# EAGLE design Mxxx (EAGLE 6.6.0)

## Sheet 1 of 6
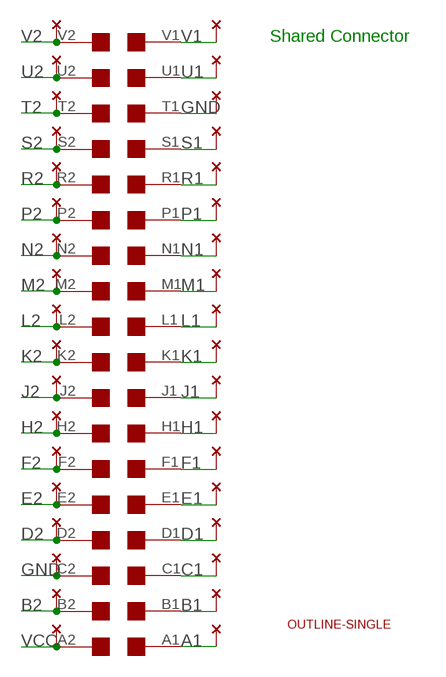
[diagram p0: schematic, sheet 1]

### Parts
U$1  EDGE-2CONNECTOR  [EDGE-CON2]
U$4  THRU-HOLE2A  [THRU-HOLEA]
U$5  OUTLINE-SINGLE  [SINGLE]

### Nets
A1: U$1.A1 U$4.A1 ; also sheet 2,3,4,5,6
B1: U$1.B1 U$4.B1 ; also sheet 2,3,4,5,6
B2: U$1.B2 U$4.B2
C1: U$1.C1 U$4.C1 ; also sheet 2,3,4,5,6
D1: U$1.D1 U$4.D1 ; also sheet 2,3,4,5,6
D2: U$1.D2 U$4.D2 ; also sheet 2,3,4,5,6
E1: U$1.E1 U$4.E1 ; also sheet 2,3,4,5
E2: U$1.E2 U$4.E2 ; also sheet 2,3,4,5,6
F1: U$1.F1 U$4.F1 ; also sheet 2,3,4,5,6
F2: U$1.F2 U$4.F2 ; also sheet 2,3,4,5,6
GND [Power]: U$1.C2 U$1.T1 U$4.C2 U$4.T1 ; also sheet 2,3,4,5,6
H1: U$1.H1 U$4.H1 ; also sheet 2,3,4,5,6
H2: U$1.H2 U$4.H2 ; also sheet 2,3,4,5,6
J1: U$1.J1 U$4.J1 ; also sheet 2,3,4,5,6
J2: U$1.J2 U$4.J2 ; also sheet 2,3,4,5,6
K1: U$1.K1 U$4.K1 ; also sheet 2,3,4,5,6
K2: U$1.K2 U$4.K2 ; also sheet 2,3,4,5,6
L1: U$1.L1 U$4.L1 ; also sheet 2,3,4,5
L2: U$1.L2 U$4.L2 ; also sheet 2,3,4,5,6
M1: U$1.M1 U$4.M1 ; also sheet 2,3,4,5,6
M2: U$1.M2 U$4.M2 ; also sheet 2,3,4,5,6
N1: U$1.N1 U$4.N1 ; also sheet 2,3,4,5,6
N2: U$1.N2 U$4.N2 ; also sheet 2,3,4,5,6
P1: U$1.P1 U$4.P1 ; also sheet 2,3,4,5,6
P2: U$1.P2 U$4.P2 ; also sheet 2,3,4,5,6
R1: U$1.R1 U$4.R1 ; also sheet 2,3,4,5,6
R2: U$1.R2 U$4.R2 ; also sheet 2,3,4,5,6
S1: U$1.S1 U$4.S2 ; also sheet 2,3,4,5
S2: U$1.S2 U$4.S1 ; also sheet 2,3,4,5,6
T2: U$1.T2 U$4.T2 ; also sheet 2,3,4,5,6
U1: U$1.U1 U$4.U1 ; also sheet 2,3,4
U2: U$1.U2 U$4.U2 ; also sheet 2,3,4,5,6
V1: U$1.V1 U$4.V1 ; also sheet 2,3,4
V2: U$1.V2 U$4.V2 ; also sheet 2,3,4,5,6
VCC [Power]: U$1.A2 U$4.A2 ; also sheet 2,3,4,5,6

### Notes on the sheet
- Shared Connector

## Sheet 2 of 6
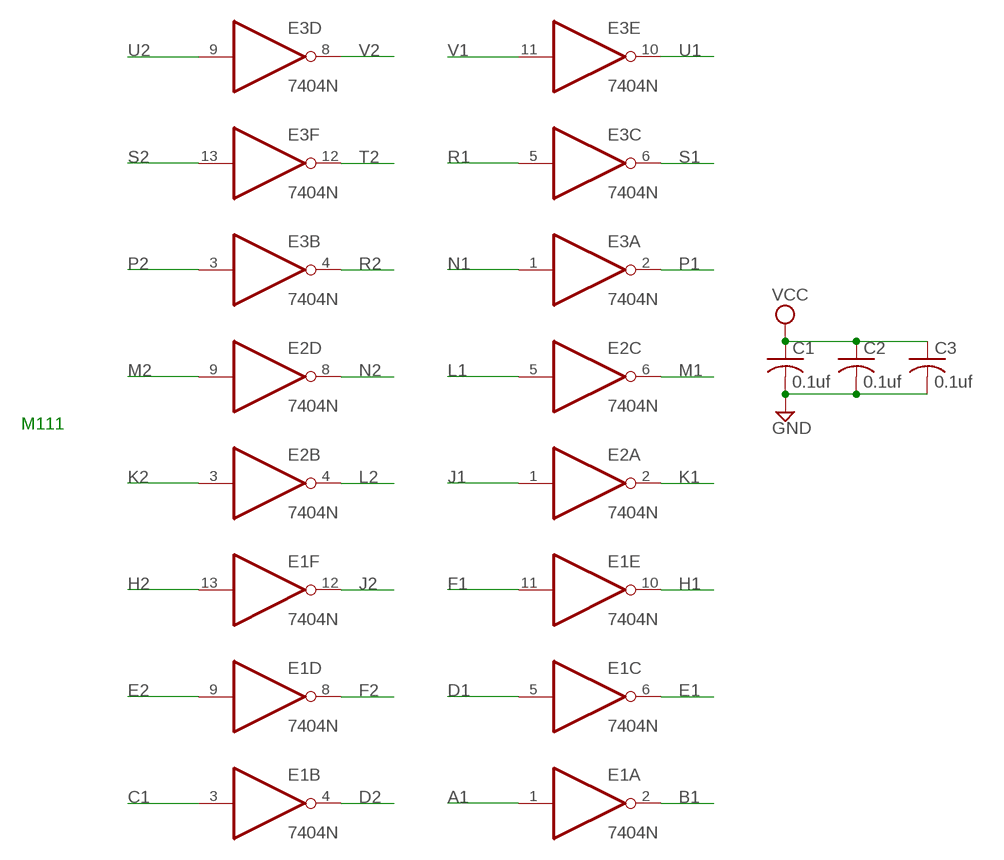
[diagram p1: schematic, sheet 2]

### Parts
C1  0.1uf  C-US050-025X075  [C050-025X075]
C2  0.1uf  C-US050-025X075  [C050-025X075]
C3  0.1uf  C-US050-025X075  [C050-025X075]
E1  7404N  [DIL14]
E2  7404N  [DIL14]
E3  7404N  [DIL14]

### Nets
A1: E1.1(A:I) ; also sheet 1,3,4,5,6
B1: E1.2(A:O) ; also sheet 1,3,4,5,6
C1: E1.3(B:I) ; also sheet 1,3,4,5,6
D1: E1.5(C:I) ; also sheet 1,3,4,5,6
D2: E1.4(B:O) ; also sheet 1,3,4,5,6
E1: E1.6(C:O) ; also sheet 1,3,4,5
E2: E1.9(D:I) ; also sheet 1,3,4,5,6
F1: E1.11(E:I) ; also sheet 1,3,4,5,6
F2: E1.8(D:O) ; also sheet 1,3,4,5,6
GND [Power]: C1.2 C2.2 C3.2 ; also sheet 1,3,4,5,6
H1: E1.10(E:O) ; also sheet 1,3,4,5,6
H2: E1.13(F:I) ; also sheet 1,3,4,5,6
J1: E2.1(A:I) ; also sheet 1,3,4,5,6
J2: E1.12(F:O) ; also sheet 1,3,4,5,6
K1: E2.2(A:O) ; also sheet 1,3,4,5,6
K2: E2.3(B:I) ; also sheet 1,3,4,5,6
L1: E2.5(C:I) ; also sheet 1,3,4,5
L2: E2.4(B:O) ; also sheet 1,3,4,5,6
M1: E2.6(C:O) ; also sheet 1,3,4,5,6
M2: E2.9(D:I) ; also sheet 1,3,4,5,6
N1: E3.1(A:I) ; also sheet 1,3,4,5,6
N2: E2.8(D:O) ; also sheet 1,3,4,5,6
P1: E3.2(A:O) ; also sheet 1,3,4,5,6
P2: E3.3(B:I) ; also sheet 1,3,4,5,6
R1: E3.5(C:I) ; also sheet 1,3,4,5,6
R2: E3.4(B:O) ; also sheet 1,3,4,5,6
S1: E3.6(C:O) ; also sheet 1,3,4,5
S2: E3.13(F:I) ; also sheet 1,3,4,5,6
T2: E3.12(F:O) ; also sheet 1,3,4,5,6
U1: E3.10(E:O) ; also sheet 1,3,4
U2: E3.9(D:I) ; also sheet 1,3,4,5,6
V1: E3.11(E:I) ; also sheet 1,3,4
V2: E3.8(D:O) ; also sheet 1,3,4,5,6
VCC [Power]: C1.1 C2.1 C3.1 ; also sheet 1,3,4,5,6
Unconnected: E2.10(E:O) E2.11(E:I) E2.12(F:O) E2.13(F:I)

### Notes on the sheet
- M111

## Sheet 3 of 6
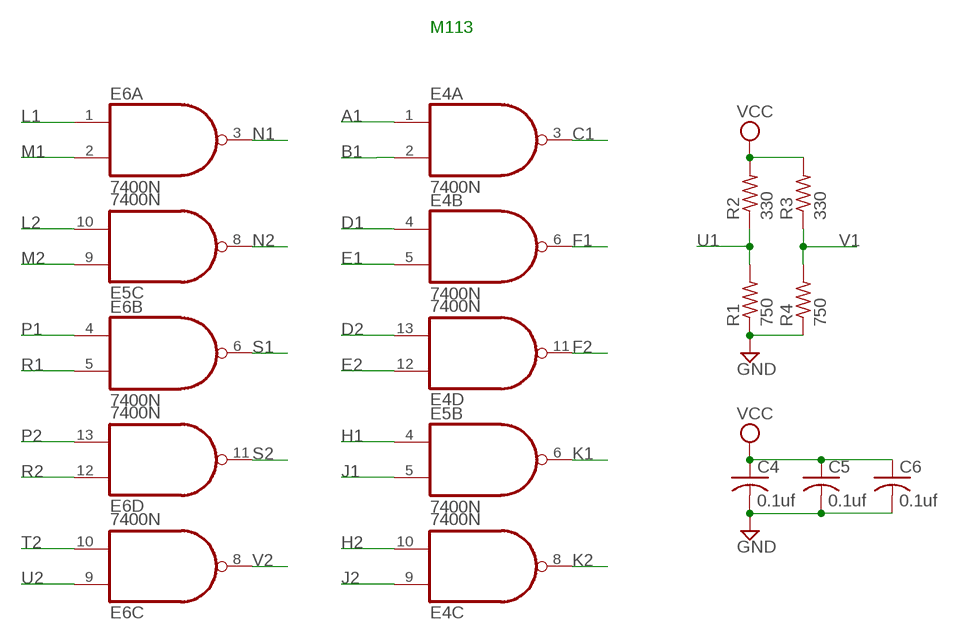
[diagram p2: schematic, sheet 3]

### Parts
C4  0.1uf  C-US050-025X075  [C050-025X075]
C5  0.1uf  C-US050-025X075  [C050-025X075]
C6  0.1uf  C-US050-025X075  [C050-025X075]
E4  7400N  [DIL14]
E5  7400N  [DIL14]
E6  7400N  [DIL14]
R1  750  R-US_0207/10  [0207/10]
R2  330  R-US_0207/10  [0207/10]
R3  330  R-US_0207/10  [0207/10]
R4  750  R-US_0207/10  [0207/10]

### Nets
A1: E4.1(A:I0) ; also sheet 1,2,4,5,6
B1: E4.2(A:I1) ; also sheet 1,2,4,5,6
C1: E4.3(A:O) ; also sheet 1,2,4,5,6
D1: E4.4(B:I0) ; also sheet 1,2,4,5,6
D2: E4.13(D:I1) ; also sheet 1,2,4,5,6
E1: E4.5(B:I1) ; also sheet 1,2,4,5
E2: E4.12(D:I0) ; also sheet 1,2,4,5,6
F1: E4.6(B:O) ; also sheet 1,2,4,5,6
F2: E4.11(D:O) ; also sheet 1,2,4,5,6
GND [Power]: C4.2 C5.2 C6.2 R1.1 R4.1 ; also sheet 1,2,4,5,6
H1: E5.4(B:I0) ; also sheet 1,2,4,5,6
H2: E4.10(C:I1) ; also sheet 1,2,4,5,6
J1: E5.5(B:I1) ; also sheet 1,2,4,5,6
J2: E4.9(C:I0) ; also sheet 1,2,4,5,6
K1: E5.6(B:O) ; also sheet 1,2,4,5,6
K2: E4.8(C:O) ; also sheet 1,2,4,5,6
L1: E6.1(A:I0) ; also sheet 1,2,4,5
L2: E5.10(C:I1) ; also sheet 1,2,4,5,6
M1: E6.2(A:I1) ; also sheet 1,2,4,5,6
M2: E5.9(C:I0) ; also sheet 1,2,4,5,6
N1: E6.3(A:O) ; also sheet 1,2,4,5,6
N2: E5.8(C:O) ; also sheet 1,2,4,5,6
P1: E6.4(B:I0) ; also sheet 1,2,4,5,6
P2: E6.13(D:I1) ; also sheet 1,2,4,5,6
R1: E6.5(B:I1) ; also sheet 1,2,4,5,6
R2: E6.12(D:I0) ; also sheet 1,2,4,5,6
S1: E6.6(B:O) ; also sheet 1,2,4,5
S2: E6.11(D:O) ; also sheet 1,2,4,5,6
T2: E6.10(C:I1) ; also sheet 1,2,4,5,6
U1: R1.2 R2.1 ; also sheet 1,2,4
U2: E6.9(C:I0) ; also sheet 1,2,4,5,6
V1: R3.1 R4.2 ; also sheet 1,2,4
V2: E6.8(C:O) ; also sheet 1,2,4,5,6
VCC [Power]: C4.1 C5.1 C6.1 R2.2 R3.2 ; also sheet 1,2,4,5,6
Unconnected: E5.1(A:I0) E5.2(A:I1) E5.3(A:O) E5.11(D:O) E5.12(D:I0) E5.13(D:I1)

### Notes on the sheet
- M113

## Sheet 4 of 6
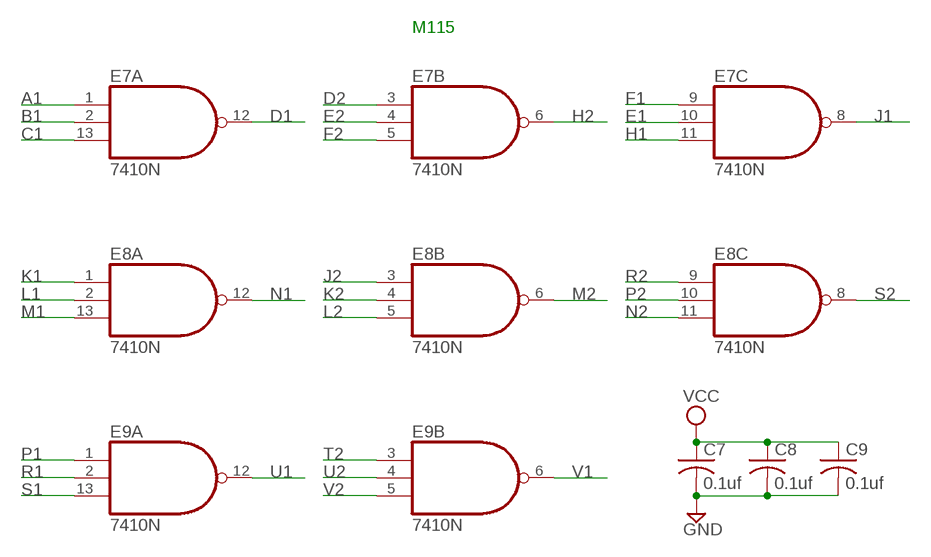
[diagram p3: schematic, sheet 4]

### Parts
C7  0.1uf  C-US050-025X075  [C050-025X075]
C8  0.1uf  C-US050-025X075  [C050-025X075]
C9  0.1uf  C-US050-025X075  [C050-025X075]
E7  7410N  [DIL14]
E8  7410N  [DIL14]
E9  7410N  [DIL14]

### Nets
A1: E7.1(A:I0) ; also sheet 1,2,3,5,6
B1: E7.2(A:I1) ; also sheet 1,2,3,5,6
C1: E7.13(A:I2) ; also sheet 1,2,3,5,6
D1: E7.12(A:O) ; also sheet 1,2,3,5,6
D2: E7.3(B:I0) ; also sheet 1,2,3,5,6
E1: E7.10(C:I1) ; also sheet 1,2,3,5
E2: E7.4(B:I1) ; also sheet 1,2,3,5,6
F1: E7.9(C:I0) ; also sheet 1,2,3,5,6
F2: E7.5(B:I2) ; also sheet 1,2,3,5,6
GND [Power]: C7.2 C8.2 C9.2 ; also sheet 1,2,3,5,6
H1: E7.11(C:I2) ; also sheet 1,2,3,5,6
H2: E7.6(B:O) ; also sheet 1,2,3,5,6
J1: E7.8(C:O) ; also sheet 1,2,3,5,6
J2: E8.3(B:I0) ; also sheet 1,2,3,5,6
K1: E8.1(A:I0) ; also sheet 1,2,3,5,6
K2: E8.4(B:I1) ; also sheet 1,2,3,5,6
L1: E8.2(A:I1) ; also sheet 1,2,3,5
L2: E8.5(B:I2) ; also sheet 1,2,3,5,6
M1: E8.13(A:I2) ; also sheet 1,2,3,5,6
M2: E8.6(B:O) ; also sheet 1,2,3,5,6
N1: E8.12(A:O) ; also sheet 1,2,3,5,6
N2: E8.11(C:I2) ; also sheet 1,2,3,5,6
P1: E9.1(A:I0) ; also sheet 1,2,3,5,6
P2: E8.10(C:I1) ; also sheet 1,2,3,5,6
R1: E9.2(A:I1) ; also sheet 1,2,3,5,6
R2: E8.9(C:I0) ; also sheet 1,2,3,5,6
S1: E9.13(A:I2) ; also sheet 1,2,3,5
S2: E8.8(C:O) ; also sheet 1,2,3,5,6
T2: E9.3(B:I0) ; also sheet 1,2,3,5,6
U1: E9.12(A:O) ; also sheet 1,2,3
U2: E9.4(B:I1) ; also sheet 1,2,3,5,6
V1: E9.6(B:O) ; also sheet 1,2,3
V2: E9.5(B:I2) ; also sheet 1,2,3,5,6
VCC [Power]: C7.1 C8.1 C9.1 ; also sheet 1,2,3,5,6
Unconnected: E9.8(C:O) E9.9(C:I0) E9.10(C:I1) E9.11(C:I2)

### Notes on the sheet
- M115

## Sheet 5 of 6
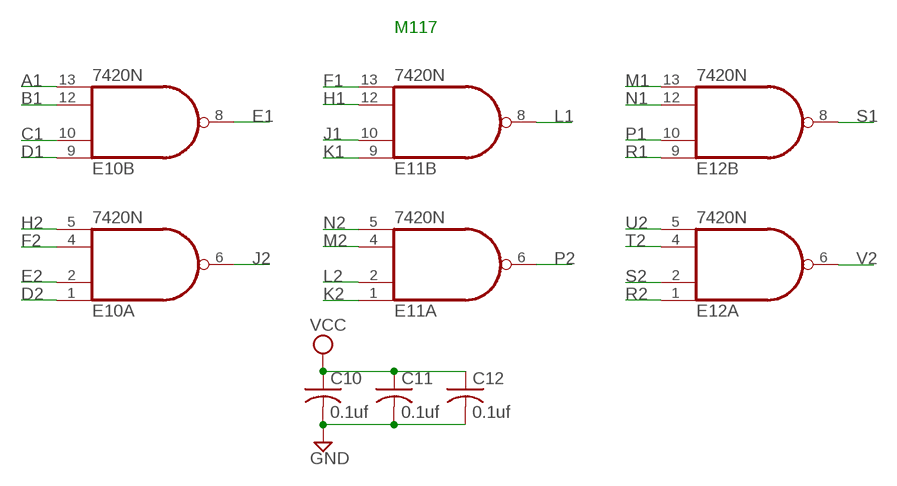
[diagram p4: schematic, sheet 5]

### Parts
C10  0.1uf  C-US050-025X075  [C050-025X075]
C11  0.1uf  C-US050-025X075  [C050-025X075]
C12  0.1uf  C-US050-025X075  [C050-025X075]
E10  7420N  74S20N  [DIL14]
E11  7420N  74S20N  [DIL14]
E12  7420N  74S20N  [DIL14]

### Nets
A1: E10.13(B:I3) ; also sheet 1,2,3,4,6
B1: E10.12(B:I2) ; also sheet 1,2,3,4,6
C1: E10.10(B:I1) ; also sheet 1,2,3,4,6
D1: E10.9(B:I0) ; also sheet 1,2,3,4,6
D2: E10.1(A:I0) ; also sheet 1,2,3,4,6
E1: E10.8(B:O) ; also sheet 1,2,3,4
E2: E10.2(A:I1) ; also sheet 1,2,3,4,6
F1: E11.13(B:I3) ; also sheet 1,2,3,4,6
F2: E10.4(A:I2) ; also sheet 1,2,3,4,6
GND [Power]: C10.2 C11.2 C12.2 ; also sheet 1,2,3,4,6
H1: E11.12(B:I2) ; also sheet 1,2,3,4,6
H2: E10.5(A:I3) ; also sheet 1,2,3,4,6
J1: E11.10(B:I1) ; also sheet 1,2,3,4,6
J2: E10.6(A:O) ; also sheet 1,2,3,4,6
K1: E11.9(B:I0) ; also sheet 1,2,3,4,6
K2: E11.1(A:I0) ; also sheet 1,2,3,4,6
L1: E11.8(B:O) ; also sheet 1,2,3,4
L2: E11.2(A:I1) ; also sheet 1,2,3,4,6
M1: E12.13(B:I3) ; also sheet 1,2,3,4,6
M2: E11.4(A:I2) ; also sheet 1,2,3,4,6
N1: E12.12(B:I2) ; also sheet 1,2,3,4,6
N2: E11.5(A:I3) ; also sheet 1,2,3,4,6
P1: E12.10(B:I1) ; also sheet 1,2,3,4,6
P2: E11.6(A:O) ; also sheet 1,2,3,4,6
R1: E12.9(B:I0) ; also sheet 1,2,3,4,6
R2: E12.1(A:I0) ; also sheet 1,2,3,4,6
S1: E12.8(B:O) ; also sheet 1,2,3,4
S2: E12.2(A:I1) ; also sheet 1,2,3,4,6
T2: E12.4(A:I2) ; also sheet 1,2,3,4,6
U2: E12.5(A:I3) ; also sheet 1,2,3,4,6
V2: E12.6(A:O) ; also sheet 1,2,3,4,6
VCC [Power]: C10.1 C11.1 C12.1 ; also sheet 1,2,3,4,6

### Notes on the sheet
- M117

## Sheet 6 of 6
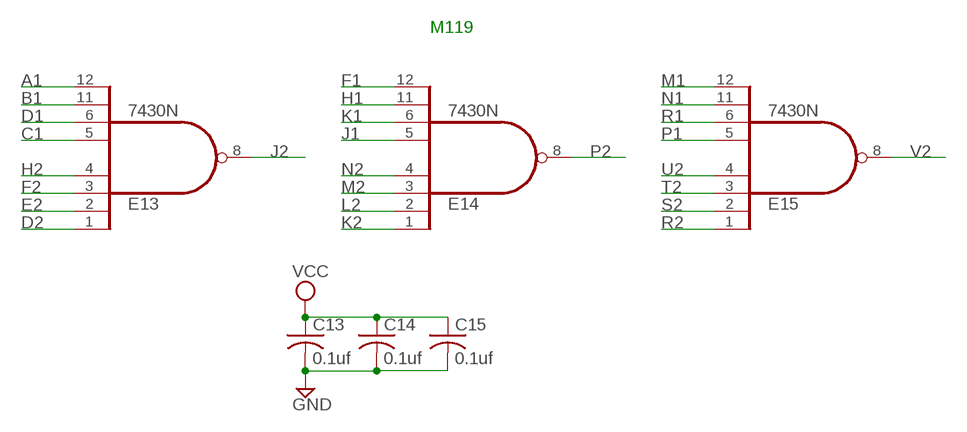
[diagram p5: schematic, sheet 6]

### Parts
C13  0.1uf  C-US050-025X075  [C050-025X075]
C14  0.1uf  C-US050-025X075  [C050-025X075]
C15  0.1uf  C-US050-025X075  [C050-025X075]
E13  7430N  [DIL14]
E14  7430N  [DIL14]
E15  7430N  [DIL14]

### Nets
A1: E13.12(I7) ; also sheet 1,2,3,4,5
B1: E13.11(I6) ; also sheet 1,2,3,4,5
C1: E13.5(I4) ; also sheet 1,2,3,4,5
D1: E13.6(I5) ; also sheet 1,2,3,4,5
D2: E13.1(I0) ; also sheet 1,2,3,4,5
E2: E13.2(I1) ; also sheet 1,2,3,4,5
F1: E14.12(I7) ; also sheet 1,2,3,4,5
F2: E13.3(I2) ; also sheet 1,2,3,4,5
GND [Power]: C13.2 C14.2 C15.2 ; also sheet 1,2,3,4,5
H1: E14.11(I6) ; also sheet 1,2,3,4,5
H2: E13.4(I3) ; also sheet 1,2,3,4,5
J1: E14.5(I4) ; also sheet 1,2,3,4,5
J2: E13.8(O) ; also sheet 1,2,3,4,5
K1: E14.6(I5) ; also sheet 1,2,3,4,5
K2: E14.1(I0) ; also sheet 1,2,3,4,5
L2: E14.2(I1) ; also sheet 1,2,3,4,5
M1: E15.12(I7) ; also sheet 1,2,3,4,5
M2: E14.3(I2) ; also sheet 1,2,3,4,5
N1: E15.11(I6) ; also sheet 1,2,3,4,5
N2: E14.4(I3) ; also sheet 1,2,3,4,5
P1: E15.5(I4) ; also sheet 1,2,3,4,5
P2: E14.8(O) ; also sheet 1,2,3,4,5
R1: E15.6(I5) ; also sheet 1,2,3,4,5
R2: E15.1(I0) ; also sheet 1,2,3,4,5
S2: E15.2(I1) ; also sheet 1,2,3,4,5
T2: E15.3(I2) ; also sheet 1,2,3,4,5
U2: E15.4(I3) ; also sheet 1,2,3,4,5
V2: E15.8(O) ; also sheet 1,2,3,4,5
VCC [Power]: C13.1 C14.1 C15.1 ; also sheet 1,2,3,4,5

### Notes on the sheet
- M119

## Power pins joined to a net without a drawn wire
GND: E1.7(P:GND) E2.7(P:GND) E3.7(P:GND) E4.7(P:GND) E5.7(P:GND) E6.7(P:GND) E7.7(P:GND) E8.7(P:GND) E9.7(P:GND) E10.7(P:GND) E11.7(P:GND) E12.7(P:GND) E13.7(GND) E14.7(GND) E15.7(GND)
VCC: E1.14(P:VCC) E2.14(P:VCC) E3.14(P:VCC) E4.14(P:VCC) E5.14(P:VCC) E6.14(P:VCC) E7.14(P:VCC) E8.14(P:VCC) E9.14(P:VCC) E10.14(P:VCC) E11.14(P:VCC) E12.14(P:VCC) E13.14(VCC) E14.14(VCC) E15.14(VCC)

## Library data of the parts
C1-C15 = rcl:C-US: CAPACITOR, American symbol
E1-E3 = 74xx-us:74*04: Hex INVERTER
E4-E6 = 74xx-us:74*00: Quad 2-input NAND gate
E7-E9 = 74xx-us:74*10: Triple 3-input NAND gate
E10-E12 = 74xx-us:74*20: Dual 4-input NAND gate
E13-E15 = 74xx-us:74*30: 8-input NAND gate
R1-R4 = rcl:R-US_: RESISTOR, American symbol
U$1 = dec-con:EDGE-2: Double-Sided DEC edge connector.
U$4 = dec-con:THRU-HOLE2: Thru-Hole addition to double-sided edge connector.
U$5 = dec-con:OUTLINE-*: Board outlines for DEC boards.

## Net classes
1 Power: width 0.381 mm

## Board
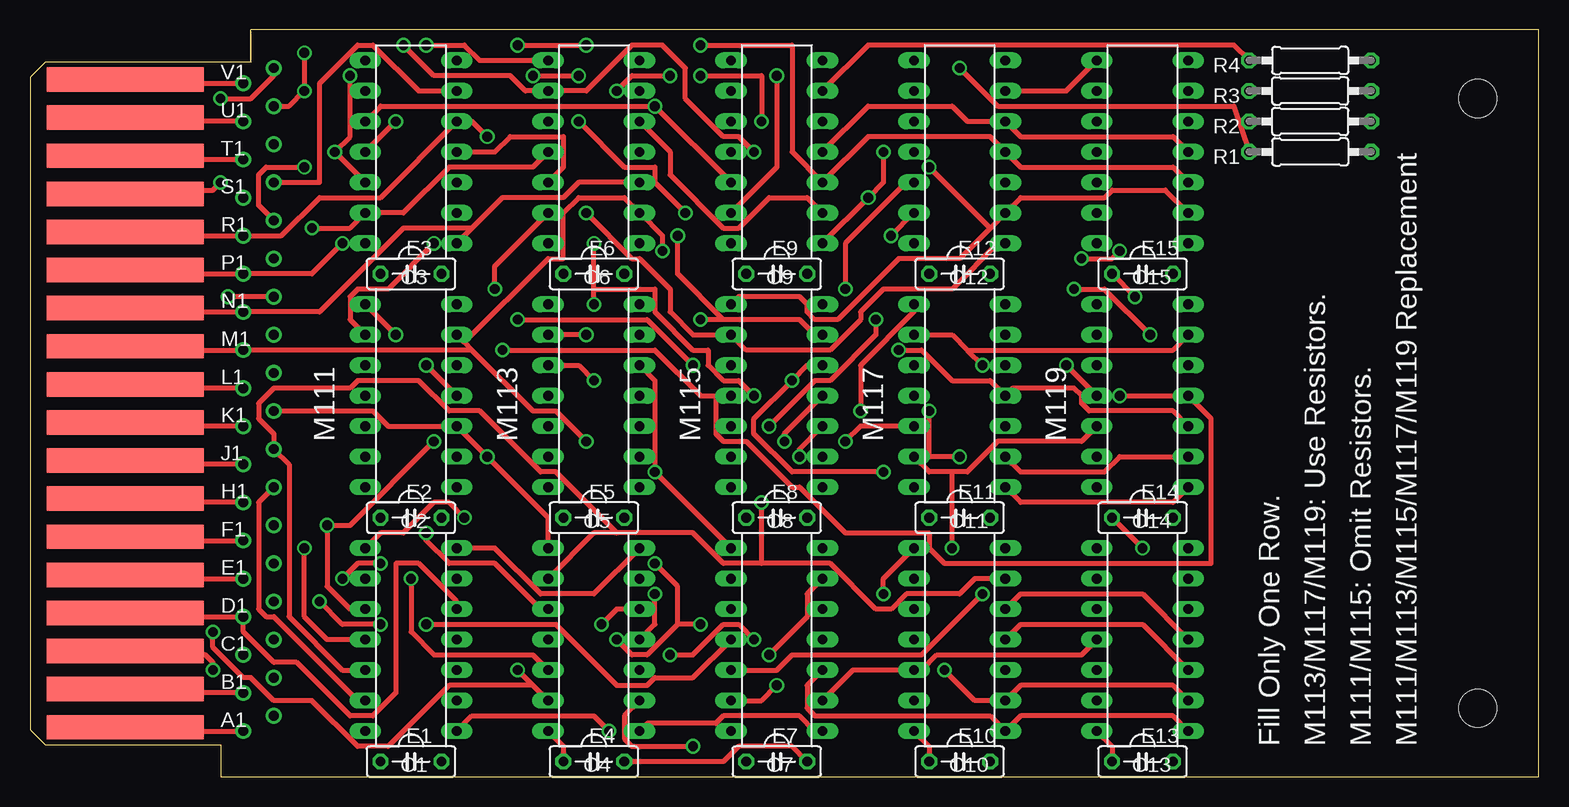
[diagram p6: board, top side]
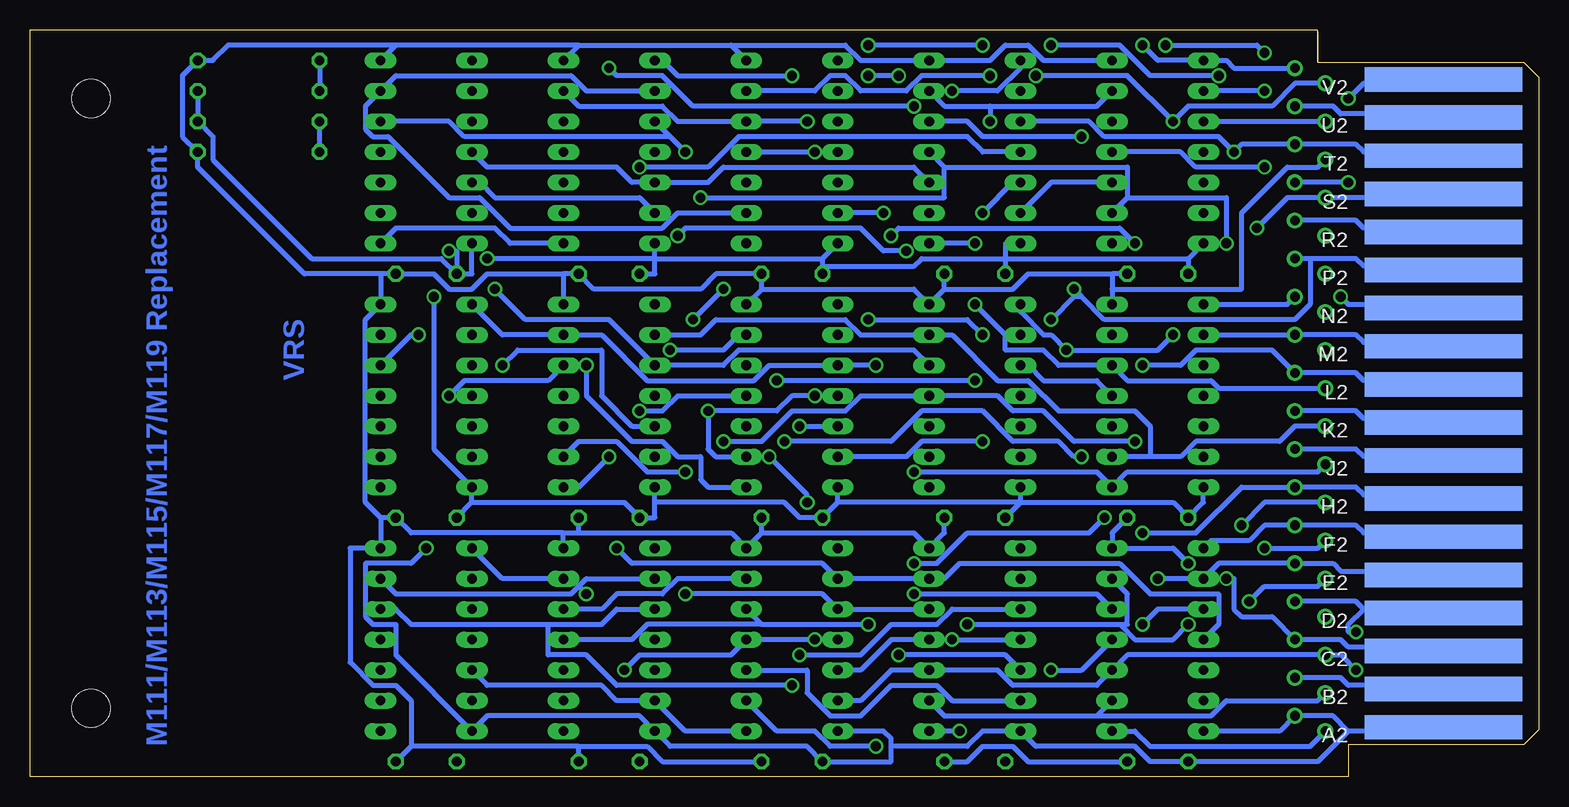
[diagram p7: board, bottom side, seen from below]

Size 125.73 x 62.23 mm. Coordinates in mm from the lower left corner, seen from the top.
Copper layers (1+16): Top 0.035mm / dielectric 1.5mm / Bottom 0.035mm
Design rules "16mils": minimum track width 16mil, minimum drill 32mil, track to track 15mil, track to pad 10mil, pad to pad 10mil, via to via 10mil, smd to smd 10mil, copper to edge 13mil, drill to drill 10mil, minimum pad ring 10mil, minimum via ring 8mil, stop-mask expansion 0mil, vias tented up to drill 0mil, thermal gap 10mil

### Footprints (pad centres in the part's own frame; a part is rotated, then mirrored left to right if it is on the bottom)
C050-025X075 = drill 0.813 octagon: 1 -2.54,0; 2 2.54,0
DIL14 = drill 0.813 long: 1 -7.62,-3.81; 2 -5.08,-3.81; 3 -2.54,-3.81; 4 0,-3.81; 5 2.54,-3.81; 6 5.08,-3.81; 7 7.62,-3.81; 8 7.62,3.81; 9 5.08,3.81; 10 2.54,3.81; 11 0,3.81; 12 -2.54,3.81; 13 -5.08,3.81; 14 -7.62,3.81
0207/10 = drill 0.813 octagon: 1 -5.08,0; 2 5.08,0
EDGE-CON2 = smd 13.106 x 2.032: A1 7.938,4.128; B1 7.938,7.303; C1 7.938,10.477; D1 7.938,13.652; E1 7.938,16.828; F1 7.938,20.003; H1 7.938,23.177; J1 7.938,26.352; K1 7.938,29.527; L1 7.938,32.703; M1 7.938,35.877; N1 7.938,39.053; P1 7.938,42.227; R1 7.938,45.403; S1 7.938,48.578; T1 7.938,51.752; U1 7.938,54.928; V1 7.938,58.102 | smd 13.106 x 2.032 bottom: A2 7.938,4.128; B2 7.938,7.303; C2 7.938,10.477; D2 7.938,13.652; E2 7.938,16.828; F2 7.938,20.003; H2 7.938,23.177; J2 7.938,26.352; K2 7.938,29.527; L2 7.938,32.703; M2 7.938,35.877; N2 7.938,39.053; P2 7.938,42.227; R2 7.938,45.403; S2 7.938,48.578; T2 7.938,51.752; U2 7.938,54.928; V2 7.938,58.102
THRU-HOLEA = drill 0.813 pad 1.27: A1 17.78,3.81; A2 20.32,5.08; B1 17.78,6.985; B2 20.32,8.255; C1 17.78,10.16; C2 20.32,11.43; D1 17.78,13.335; D2 20.32,14.605; E1 17.78,16.51; E2 20.32,17.78; F1 17.78,19.685; F2 20.32,20.955; H1 17.78,22.86; H2 20.32,24.13; J1 17.78,26.035; J2 20.32,27.305; K1 17.78,29.21; K2 20.32,30.48; L1 17.78,32.385; L2 20.32,33.655; M1 17.78,35.56; M2 20.32,36.83; N1 17.78,38.735; N2 20.32,40.005; P1 17.78,41.91; P2 20.32,43.18; R1 17.78,45.085; R2 20.32,46.355; S1 17.78,48.26; S2 20.32,49.53; T1 17.78,51.435; T2 20.32,52.705; U1 17.78,54.61; U2 20.32,55.88; V1 17.78,57.785; V2 20.32,59.055
SINGLE = hole 3.175: 120.65,56.515; 120.65,5.715

### Placement (x,y rotation side)
C1  31.75,1.27 0 top
C2  31.75,21.59 0 top
C3  31.75,41.91 0 top
C4  46.99,1.27 0 top
C5  46.99,21.59 0 top
C6  46.99,41.91 0 top
C7  62.23,1.27 0 top
C8  62.23,21.59 0 top
C9  62.23,41.91 0 top
C10  77.47,1.27 0 top
C11  77.47,21.59 0 top
C12  77.47,41.91 0 top
C13  92.71,1.27 0 top
C14  92.71,21.59 0 top
C15  92.71,41.91 0 top
E1  31.75,11.43 90 top
E2  31.75,31.75 90 top
E3  31.75,52.07 90 top
E4  46.99,11.43 90 top
E5  46.99,31.75 90 top
E6  46.99,52.07 90 top
E7  62.23,11.43 90 top
E8  62.23,31.75 90 top
E9  62.23,52.07 90 top
E10  77.47,11.43 90 top
E11  77.47,31.75 90 top
E12  77.47,52.07 90 top
E13  92.71,11.43 90 top
E14  92.71,31.75 90 top
E15  92.71,52.07 90 top
R1  106.68,52.07 180 top
R2  106.68,54.61 0 top
R3  106.68,57.15 0 top
R4  106.68,59.69 180 top
U$1  0,0 0 top
U$4  0,0 0 top
U$5  0,0 0 top

### Tracks (layer width: path | path; a pad name or v marks a point on that pad's centre or on a via)
A1  (via drill 0.81)
  Top 0.406: E4.1 51.44,4.45 57.15,4.45 57.79,5.08 64.14,5.08 65.41,3.81 E7.1 | U$4.A1 8.26,3.81 U$1.A1 | v48.26,3.81 46.99,5.08 36.83,5.08 E1.1
  Bottom 0.406: E7.1 71.12,3.81 E10.13 76.84,6.35 78.11,7.62 87.63,7.62 E13.12 | U$4.A1 19.05,2.54 32.39,2.54 33.66,3.81 E1.1 | v48.26,3.81 E4.1
B1  (via drill 0.81)
  Top 0.406: E7.2 68.58,8.89 E10.12 74.3,8.89 75.57,10.16 87.63,10.16 E13.11 | v55.25,2.54 50.17,2.54 49.53,3.17 49.53,5.08 E4.2 | U$4.B1 8.26,6.99 U$1.B1
  Bottom 0.406: 36.83,5.08 E1.2 | 36.83,5.08 49.53,5.08 E4.2 | U$4.B1 18.42,6.35 26.04,6.35 27.31,5.08 36.83,5.08 | E7.2 63.5,3.81 60.33,3.81 59.06,2.54 v55.25,2.54
B2
  Bottom 0.406: U$4.B2 16.51,8.26 15.88,7.62 8.26,7.62 U$1.B2
C1  (via drill 0.81)
  Top 0.406: v62.23,7.62 60.96,6.35 E7.13 | v15.24,8.89 15.24,9.53 14.61,10.16 8.26,10.16 U$1.C1
  Bottom 0.406: E10.10 76.84,13.97 78.11,12.7 82.55,12.7 | 82.55,12.7 93.98,12.7 95.25,13.97 E13.5 | E7.13 56.52,6.35 53.98,8.89 E4.3 45.09,8.89 43.82,7.62 36.83,7.62 E1.3 34.29,10.16 U$4.C1 16.51,10.16 v15.24,8.89 | 82.55,12.7 82.55,10.16 79.38,10.16 76.84,7.62 v62.23,7.62
D1  (via drill 0.81)
  Top 0.406: U$1.D1 8.26,13.34 U$4.D1 17.78,12.06 20.32,9.53 22.23,9.53 26.67,5.08 28.58,5.08 30.48,6.99 30.48,17.78 32.39,17.78 35.56,14.61 E1.5 | v52.07,15.24 52.07,12.7 E4.4 | v79.38,15.24 74.3,10.16 63.5,10.16 62.23,8.89 E7.12
  Bottom 0.406: E10.9 79.38,16.51 80.01,15.88 | 80.01,15.88 80.65,15.24 95.25,15.24 E13.6 | E7.12 56.52,8.89 53.98,11.43 E4.4 | E1.5 36.83,15.24 v52.07,15.24 | v79.38,15.24 80.01,15.88
D2  (via drill 0.81)
  Top 0.406: E13.1 95.25,5.08 82.55,5.08 E10.1 80.01,5.08 65.41,5.08 64.77,5.71 64.77,7.62 E7.3 | E4.13 41.91,7.62 | 41.91,7.62 v40.64,8.89 | v15.24,12.06 15.24,10.79 17.78,8.26 18.42,8.26 20.32,6.35 23.5,6.35 27.31,2.54 29.85,2.54 34.93,7.62 41.91,7.62
  Bottom 0.406: U$4.D2 15.24,14.61 14.61,13.97 | 14.61,13.97 8.26,13.97 U$1.D2 | E4.13 48.9,6.35 50.17,7.62 53.98,7.62 56.52,5.08 59.06,5.08 60.96,6.99 60.96,8.89 E7.3 | E1.4 38.1,8.89 v40.64,8.89 | 14.61,13.97 15.88,12.7 15.88,12.06 v15.24,12.06
E1  (via drill 0.81)
  Top 0.406: U$4.E1 8.26,16.51 U$1.E1 | v47.63,12.7 48.9,13.97 E4.5 | E10.8 71.12,16.51 v71.12,15.24 | v24.13,14.61 26.04,12.7 v29.21,12.7
  Bottom 0.406: E4.5 E7.10 59.69,15.24 v71.12,15.24 | E1.6 34.29,15.24 34.29,12.7 34.93,12.7 | v47.63,12.7 34.93,12.7 | U$4.E1 18.42,15.88 22.86,15.88 v24.13,14.61 | v29.21,12.7 30.48,11.43 33.66,11.43 34.93,12.7
E2  (via drill 0.81)
  Top 0.406: E13.2 95.25,7.62 82.55,7.62 E10.2 78.74,6.35 v76.2,8.89 | E4.12 41.91,10.16 33.66,10.16 31.75,12.06 v31.75,16.51 | v60.33,11.43 59.06,12.7 57.79,12.7 55.25,10.16 v53.34,10.16
  Bottom 0.406: v76.2,8.89 74.93,10.16 67.31,10.16 E7.4 v60.33,11.43 | v31.75,16.51 E1.9 26.67,17.78 U$4.E2 17.15,17.78 16.51,17.14 8.26,17.14 U$1.E2 | v53.34,10.16 44.45,10.16 E4.12
F1  (via drill 0.81)
  Top 0.406: U$4.F1 8.26,19.68 U$1.F1 | E11.13 74.93,25.4 76.84,25.4 | 76.84,25.4 78.11,25.4 80.65,27.94 87.63,27.94 E14.12 | v76.84,19.05 76.84,25.4 | v22.86,19.05 22.86,13.34 24.77,11.43 E1.11
  Bottom 0.406: E1.11 26.67,12.7 26.67,15.24 32.39,15.24 34.93,17.78 48.26,17.78 49.53,16.51 E4.6 E7.9 59.69,17.78 75.57,17.78 v76.84,19.05 | U$4.F1 18.42,19.05 v22.86,19.05
F2  (via drill 0.81)
  Top 0.406: v48.9,11.43 50.17,10.16 51.44,10.16 53.98,12.7 | v55.88,12.7 53.98,12.7 | E13.3 92.71,12.7 82.55,12.7 E10.4 | E1.8 29.21,20.32 31.12,20.32 33.66,22.86 34.93,22.86 v36.2,21.59 | v52.07,17.78 53.98,15.88 53.98,12.7
  Bottom 0.406: E1.8 27.31,19.68 24.13,19.68 22.86,20.95 U$4.F2 15.24,20.95 14.61,20.32 8.26,20.32 U$1.F2 | v48.9,11.43 E4.11 | 64.77,12.7 v55.88,12.7 | E7.5 64.77,12.7 | E10.4 75.57,11.43 74.3,12.7 64.77,12.7 | v36.2,21.59 37.47,20.32 47.63,20.32 50.17,17.78 v52.07,17.78
GND  (via drill 0.81)
  Top 0.406: U$4.T1 8.26,51.44 U$1.T1 | C4.2 57.79,1.27 59.06,2.54 63.5,2.54 C7.2 | E1.7 38.74,19.05 42.55,15.24 46.99,15.24 E4.7 | v26.04,16.51 27.31,17.78 v29.21,17.78
  Bottom 0.406: 35.56,41.91 35.56,40.64 | 35.56,40.64 E2.7 | C3.2 35.56,41.91 | U$4.T1 18.42,50.8 20.96,50.8 24.77,46.99 24.77,40.64 35.56,40.64 | 81.28,41.91 E11.7 | 81.28,41.91 C12.2 78.74,40.64 69.85,40.64 68.58,41.91 C9.2 64.77,40.64 | 49.53,40.64 C6.2 | 49.53,40.64 E5.7 52.07,40.64 64.77,40.64 | E8.7 64.77,40.64 | 35.56,41.91 42.55,41.91 43.82,40.64 49.53,40.64 | E3.7 41.28,59.69 42.55,60.96 44.45,60.96 45.72,59.69 E6.7 56.52,59.69 57.79,60.96 67.31,60.96 | 67.31,60.96 E9.7 | 80.01,60.96 67.31,60.96 | E12.7 80.01,60.96 | 95.25,60.96 E15.7 | 80.01,60.96 95.25,60.96 | 95.25,60.96 109.22,60.96 110.49,59.69 R4.1 113.03,58.42 113.03,53.34 R1.1 111.76,50.8 102.87,41.91 96.52,41.91 | C1.2 42.55,1.27 43.82,2.54 46.36,2.54 47.63,1.27 C4.2 | C7.2 73.03,1.27 74.3,2.54 80.01,2.54 | C10.2 80.01,2.54 | 93.98,2.54 C13.2 | 80.01,2.54 93.98,2.54 | U$1.C2 8.26,10.79 15.88,10.79 16.51,11.43 U$4.C2 22.23,13.34 24.77,13.34 25.4,13.97 25.4,16.51 v26.04,16.51 | C2.2 35.56,20.32 E1.7 30.48,19.05 v29.21,17.78 | C5.2 49.53,20.32 E4.7 52.07,20.32 64.77,20.32 | 96.52,41.91 E14.7 97.79,38.1 97.79,22.86 96.52,21.59 | 96.52,41.91 C15.2 92.08,41.91 90.81,40.64 88.9,40.64 87.63,41.91 81.28,41.91 | 96.52,21.59 E13.7 99.06,19.05 99.06,9.53 97.16,7.62 95.25,7.62 93.98,6.35 93.98,2.54 | 96.52,21.59 C14.2 93.98,20.32 81.28,20.32 | 64.77,20.32 C8.2 | 64.77,20.32 E7.7 67.31,20.32 80.01,20.32 | 80.01,20.32 C11.2 | E10.7 81.28,20.32 | 81.28,20.32 80.01,20.32
H1  (via drill 0.81)
  Top 0.406: E14.11 v86.36,34.29 | v67.95,27.94 69.22,29.21 E11.12 | E1.10 26.67,13.97 24.77,15.88 v24.77,20.95 26.67,20.95 v33.66,27.94 | E7.11 55.25,8.26 52.07,8.26 51.44,7.62 48.9,7.62 43.82,12.7 v33.02,12.7 | U$4.H1 8.26,22.86 U$1.H1
  Bottom 0.406: E11.12 75.57,29.21 78.11,31.75 78.11,35.56 85.09,35.56 v86.36,34.29 | v67.95,27.94 64.77,27.94 62.23,30.48 57.79,30.48 56.52,31.75 E5.4 45.09,31.75 43.82,30.48 41.28,30.48 38.74,27.94 v33.66,27.94 | v24.77,20.95 22.86,22.86 U$4.H1 | v33.02,12.7 31.75,13.97 E1.10
H2  (via drill 0.81)
  Top 0.406: E1.13 27.31,6.35 20.32,13.34 19.69,13.34 19.05,13.97 19.05,22.86 U$4.H2 | v61.6,10.16 64.77,13.34 64.77,15.24 E7.6 | E13.4 92.71,15.24 82.55,15.24 E10.5 | v33.02,20.32 33.02,19.68 34.93,17.78 38.74,17.78 42.55,13.97 E4.10
  Bottom 0.406: U$1.H2 8.26,23.5 14.61,23.5 15.24,24.13 U$4.H2 24.77,24.13 28.58,20.32 v33.02,20.32 | E4.10 48.9,13.97 50.17,12.7 53.98,12.7 56.52,10.16 v61.6,10.16 | E10.5 78.11,13.97 76.84,15.24 73.03,15.24 71.76,16.51 E7.6
J1  (via drill 0.81)
  Top 0.406: E7.8 v52.07,25.4 52.07,33.02 E5.5 | v93.35,36.83 89.54,40.64 v87,40.64 | U$4.J1 8.26,26.04 U$1.J1
  Bottom 0.406: U$4.J1 18.42,25.4 34.29,25.4 E2.1 36.83,25.4 v52.07,25.4 | E5.5 52.07,35.56 66.68,35.56 67.95,34.29 E11.10 77.47,38.1 84.46,38.1 v87,40.64 | E14.5 93.98,36.83 v93.35,36.83
J2  (via drill 0.81)
  Top 0.406: E1.12 26.04,8.89 21.59,13.34 21.59,26.04 U$4.J2 20.32,28.57 19.05,29.84 19.05,31.11 20.32,32.38 26.67,32.38 27.31,33.02 32.39,33.02 34.93,30.48 37.47,30.48 42.55,25.4 43.82,25.4 48.9,20.32 | E4.9 46.99,20.32 48.9,20.32 | 48.9,20.32 55.25,20.32 57.79,17.78 60.96,17.78 | 60.96,17.78 66.68,17.78 70.49,13.97 71.76,13.97 73.03,15.24 77.47,15.24 78.74,16.51 E10.6 | E8.3 64.14,27.3 v64.14,26.67 | 60.96,17.78 v60.96,22.86
  Bottom 0.406: U$4.J2 15.24,27.3 14.61,26.67 8.26,26.67 U$1.J2 | v64.14,26.67 60.96,23.5 v60.96,22.86 | E13.8 86.36,16.51 E10.6
K1  (via drill 0.81)
  Top 0.406: 78.11,35.56 76.84,36.83 E11.9 | 78.11,35.56 v79.38,34.29 | E14.6 95.25,35.56 78.11,35.56 | U$4.K1 8.26,29.21 U$1.K1
  Bottom 0.406: 32.39,26.67 29.85,26.67 28.58,27.94 21.59,27.94 20.32,29.21 U$4.K1 | 32.39,26.67 E2.2 | E8.1 69.22,24.13 69.85,24.77 69.85,26.67 71.76,26.67 73.03,27.94 75.57,27.94 79.38,31.75 v79.38,34.29 | E11.9 69.85,36.83 68.58,38.1 57.79,38.1 56.52,36.83 E5.6 48.9,36.83 45.09,33.02 42.55,33.02 40.01,30.48 33.66,30.48 32.39,29.21 32.39,26.67
K2  (via drill 0.81)
  Top 0.406: E11.1 82.55,22.86 95.25,22.86 E14.1 | v74.93,30.48 74.93,26.67 v77.47,26.67 | E4.8 43.18,21.59 v38.1,26.67 E2.3 29.85,29.21 28.58,30.48 U$4.K2 | E8.4 62.87,28.57 v62.87,27.94
  Bottom 0.406: E8.4 71.76,31.75 73.03,30.48 v74.93,30.48 | v77.47,26.67 80.01,24.13 E11.1 | U$4.K2 15.24,30.48 14.61,29.84 8.26,29.84 U$1.K2 | v62.87,27.94 53.98,27.94 51.44,30.48 46.36,30.48 43.82,27.94 40.01,27.94 38.74,26.67 v38.1,26.67
L1  (via drill 0.81)
  Top 0.406: v69.22,30.48 69.22,34.29 73.66,38.73 E11.8 | v46.99,39.37 46.99,40.64 | 46.99,40.64 v46.99,44.45 | v60.33,31.75 59.06,33.02 57.79,33.02 56.52,34.29 56.52,35.56 55.25,35.56 52.07,38.73 52.07,40.64 46.99,40.64 | U$4.L1 8.26,32.38 U$1.L1
  Bottom 0.406: E8.2 68.58,26.67 69.22,27.3 v69.22,30.48 63.5,30.48 62.23,31.75 v60.33,31.75 | U$4.L1 26.67,32.38 27.31,33.02 34.29,33.02 E2.5 40.01,34.29 41.28,35.56 44.45,35.56 44.45,36.83 v46.99,39.37 | v46.99,44.45 E6.1
L2  (via drill 0.81)
  Top 0.406: E8.5 64.77,34.29 v63.5,33.02 60.33,29.84 60.33,28.57 63.5,25.4 v71.12,25.4 | E14.2 90.81,26.67 89.54,25.4 82.55,25.4 E11.2 | v33.02,34.29 E2.4 | v46.99,33.02 45.72,34.29 E5.10
  Bottom 0.406: v71.12,25.4 74.3,25.4 76.84,27.94 80.01,27.94 E11.2 | E2.4 36.83,33.02 41.28,33.02 42.55,34.29 E5.10 | U$1.L2 8.26,33.02 14.61,33.02 15.24,33.66 U$4.L2 22.23,35.56 28.58,35.56 29.85,34.29 v33.02,34.29 | v46.99,33.02 v63.5,33.02
M1  (via drill 0.81)
  Top 0.406: U$1.M1 8.26,35.56 U$4.M1 36.83,35.56 | v46.36,27.94 43.82,30.48 41.91,30.48 36.83,35.56 | E2.6 36.2,36.2 | 36.2,36.2 36.83,35.56 | 36.2,36.2 43.18,43.18 44.45,43.18 44.45,46.99 45.72,48.26 49.53,48.26 E6.2 52.71,45.09 v52.71,43.81 | v71.76,45.09 E12.13
  Bottom 0.406: E12.13 74.93,48.26 87,48.26 88.27,49.53 E15.12 | E8.13 52.71,26.67 51.44,27.94 v46.36,27.94 | v71.76,45.09 71.12,45.72 56.52,45.72 54.61,43.81 v52.71,43.81
M2  (via drill 0.81)
  Top 0.406: E14.3 95.25,30.48 88.27,30.48 87.63,31.11 87.63,31.75 87,32.38 81.92,32.38 E11.4 80.01,33.02 76.84,33.02 74.3,35.56 v72.39,35.56 | v46.36,36.83 E5.9 | 57.79,38.1 64.14,38.1 65.41,36.83 E8.6 | 57.79,38.1 v55.88,38.1 | E2.9 26.67,38.1 26.67,40.01 27.31,40.64 29.85,40.64 v33.66,44.45 | v53.98,45.09 53.98,41.91 57.79,38.1
  Bottom 0.406: E2.9 U$4.M2 15.24,36.83 14.61,36.2 8.26,36.2 U$1.M2 | v46.36,36.83 47.63,38.1 v55.88,38.1 | v72.39,35.56 67.95,35.56 66.68,36.83 E8.6 | v33.66,44.45 34.93,45.72 53.34,45.72 v53.98,45.09
N1  (via drill 0.81)
  Top 0.406: U$1.N1 8.26,38.73 U$4.N1 24.13,38.73 31.12,45.72 36.83,45.72 | 36.83,45.72 39.37,48.26 44.45,48.26 45.72,49.53 E6.3 | 36.83,45.72 E3.1 | v61.6,29.21 65.41,33.02 66.68,33.02 70.49,36.83 v70.49,38.1 | v67.95,40.64 67.95,44.45 73.03,49.53 E12.12
  Bottom 0.406: v61.6,29.21 E8.12 | v67.95,40.64 v70.49,38.1 | E15.11 87.63,50.8 76.84,50.8 75.57,49.53 E12.12 69.22,49.53 67.95,50.8 52.07,50.8 E6.3
N2  (via drill 0.81)
  Top 0.406: v90.81,31.75 E14.4 98.43,29.84 98.43,17.78 76.2,17.78 74.93,19.05 74.93,20.32 67.95,20.32 64.14,24.13 63.5,24.13 59.69,27.94 57.79,27.94 57.15,28.57 57.15,31.75 | 57.15,31.75 55.88,31.75 52.07,35.56 v39.37,35.56 | 57.15,31.75 E8.11 | v30.48,36.83 E2.8 | U$4.N2 v16.51,40.01
  Bottom 0.406: v90.81,31.75 89.54,33.02 82.55,33.02 E11.5 | U$4.N2 20.96,39.37 E2.8 | E5.8 43.18,38.73 41.28,36.83 40.64,36.83 v39.37,35.56 31.75,35.56 v30.48,36.83 | v16.51,40.01 15.88,39.37 8.26,39.37 U$1.N2
P1  (via drill 0.81)
  Top 0.406: U$1.P1 8.26,41.91 U$4.P1 23.5,41.91 v26.04,44.45 | E9.1 v69.85,48.26 71.12,49.53 v71.12,52.07
  Bottom 0.406: 34.29,48.26 E3.2 | 34.29,48.26 34.29,50.8 49.53,50.8 | E6.4 49.53,50.8 | E12.10 72.39,53.34 | 72.39,53.34 v71.12,52.07 | E15.5 90.81,54.61 89.54,53.34 72.39,53.34 | 49.53,50.8 49.53,48.26 v69.85,48.26 | v26.04,44.45 26.04,48.26 34.29,48.26
P2  (via drill 0.81)
  Top 0.406: E6.13 38.74,42.55 v38.74,40.64 | v55.25,34.29 51.44,38.1 v40.64,38.1
  Bottom 0.406: E14.8 86.36,36.83 E11.6 78.11,36.83 74.3,33.02 65.41,33.02 64.14,34.29 E8.10 v55.25,34.29 | E6.13 40.64,49.53 E3.3 | 19.05,43.18 15.24,43.18 14.61,42.55 8.26,42.55 U$1.P2 | 19.05,43.18 U$4.P2 | 38.1,40.01 36.2,38.1 20.32,38.1 19.05,39.37 19.05,43.18 | 38.1,40.01 v38.74,40.64 | v40.64,38.1 38.74,40.01 38.1,40.01
R1  (via drill 0.81)
  Top 0.406: U$1.R1 8.26,45.09 U$4.R1 20.96,45.09 24.13,48.26 29.21,48.26 E3.5 36.83,54.61 v38.1,53.34 | E9.2 64.77,48.26 61.6,48.26 59.06,45.72 57.79,45.72 53.34,50.16 53.34,52.07 E6.5
  Bottom 0.406: E9.2 71.76,46.99 73.03,45.72 85.73,45.72 88.27,48.26 90.81,48.26 95.89,53.34 97.16,53.34 97.79,53.98 97.79,55.88 E15.6 95.25,58.42 80.65,58.42 79.38,57.15 E12.9 | E6.5 47.63,54.61 46.36,53.34 v38.1,53.34
R2  (via drill 0.81)
  Top 0.406: E12.1 80.65,44.45 76.84,40.64 71.12,40.64 69.22,38.73 69.22,38.1 66.68,35.56 59.69,35.56 E8.9 55.25,36.83 53.34,38.73 53.34,40.64 50.8,43.18 50.17,43.18 v46.36,46.99 | E6.12 44.45,50.8 44.45,53.34 40.01,53.34 38.74,52.07 E3.4 | v22.86,50.8 19.69,50.8 19.05,50.16 19.05,47.62 U$4.R2
  Bottom 0.406: E15.1 95.25,45.72 87,45.72 85.73,44.45 E12.1 | U$4.R2 15.24,46.35 14.61,45.72 8.26,45.72 U$1.R2 | E3.4 29.85,52.07 28.58,50.8 v22.86,50.8 | v46.36,46.99 43.82,49.53 E6.12
S1  (via drill 0.81)
  Top 0.406: E9.13 62.23,50.8 v62.23,58.42 | v15.88,49.53 15.24,48.9 8.26,48.9 U$1.S1 | E3.6 32.39,57.15 28.58,60.96 27.31,60.96 24.13,57.78 24.13,49.53 U$4.S2 | v54.61,46.99 52.07,49.53 52.07,50.8 49.53,50.8 v45.72,54.61
  Bottom 0.406: v62.23,58.42 71.76,58.42 73.03,59.69 E12.8 | E3.6 36.83,55.88 45.72,55.88 | 45.72,55.88 49.53,55.88 E6.6 | v15.88,49.53 U$4.S2 | v54.61,46.99 E9.13 | 45.72,55.88 v45.72,54.61
S2  (via drill 0.81)
  Top 0.406: E8.8 59.06,40.01 64.14,40.01 64.77,39.37 64.77,38.73 65.41,38.1 67.31,38.1 72.39,43.18 77.47,43.18 80.01,45.72 | 80.01,45.72 E12.2 82.55,48.26 89.54,48.26 90.17,48.9 94.62,48.9 E15.2 | E6.11 41.91,50.8 34.93,50.8 31.12,46.99 E3.13 26.67,45.72 v23.5,45.72 | v74.93,50.8 80.01,45.72
  Bottom 0.406: U$1.S2 8.26,48.26 U$4.S1 20.96,48.26 v23.5,45.72 | v74.93,50.8 69.22,50.8 66.68,53.34 47.63,53.34 46.36,52.07 E6.11
T2  (via drill 0.81)
  Top 0.406: E15.3 95.25,50.8 82.55,50.8 E12.4 80.01,53.34 69.85,53.34 E9.3 63.5,52.07 63.5,60.96 v55.88,60.96 | E3.12 v25.4,52.07 26.67,53.34 v26.67,58.42 | v40.64,60.96 v46.36,60.96
  Bottom 0.406: E6.10 37.47,54.61 36.2,53.34 26.67,53.34 v25.4,52.07 24.77,52.7 U$4.T2 15.24,52.7 14.61,52.07 8.26,52.07 U$1.T2 | v46.36,60.96 v55.88,60.96 | v40.64,60.96 34.93,60.96 32.39,58.42 v26.67,58.42
U1  (via drill 0.81)
  Top 0.406: E9.12 v52.07,55.88 29.21,55.88 E3.10 | R1.2 100.33,55.88 80.65,55.88 v77.47,59.05 | U$4.U1 8.26,54.61 U$1.U1
  Bottom 0.406: R1.2 R2.1 | E3.10 U$4.U1 | v77.47,59.05 76.84,58.42 73.03,58.42 70.49,55.88 v52.07,55.88
U2  (via drill 0.81)
  Top 0.406: U$4.U2 21.59,55.88 v22.86,57.15 v22.86,60.33 | E15.4 95.25,53.34 82.55,53.34 E12.5 78.11,54.61 76.84,55.88 69.85,55.88 E9.4 | v60.33,52.07 59.06,53.34 57.79,53.34 54.61,56.52 54.61,59.05 52.71,60.96 50.17,60.96 46.36,57.15 E6.9 41.28,57.15 40.01,58.42 33.66,58.42 v31.12,60.96
  Bottom 0.406: U$4.U2 17.15,55.88 16.51,55.24 8.26,55.24 U$1.U2 | v22.86,57.15 E3.9 | E9.4 v60.33,52.07 | v22.86,60.33 23.5,60.96 v31.12,60.96
V1  (via drill 0.81)
  Top 0.406: E9.6 69.85,60.96 100.33,60.96 R4.2 | v30.48,54.61 E3.11 | U$4.V1 8.26,57.78 U$1.V1 | v41.91,58.42 v45.72,58.42
  Bottom 0.406: R4.2 R3.1 | U$4.V1 20.32,57.78 22.23,55.88 29.21,55.88 v30.48,54.61 34.29,58.42 v41.91,58.42 | E9.6 60.33,57.15 59.06,58.42 57.79,58.42 56.52,57.15 52.71,57.15 51.44,58.42 v45.72,58.42
V2  (via drill 0.81)
  Top 0.406: E15.8 86.36,57.15 E12.6 | E6.8 37.47,59.69 36.2,60.96 v33.02,60.96 | U$4.V2 20.32,58.42 18.42,56.52 v15.88,56.52 | v60.96,54.61 60.96,58.42 v55.88,58.42 | v53.34,58.42 50.17,58.42 v48.9,57.15
  Bottom 0.406: E12.6 80.01,55.88 73.03,55.88 71.76,54.61 E9.5 v60.96,54.61 | U$4.V2 25.4,59.05 26.04,59.69 E3.8 31.75,59.69 v33.02,60.96 | v15.88,56.52 14.61,57.78 8.26,57.78 U$1.V2 | v53.34,58.42 v55.88,58.42 | v48.9,57.15 45.09,57.15 43.18,59.05 E6.8
VCC  (via drill 0.81)
  Top 0.406: C10.1 74.93,2.54 E10.14 | C13.1 90.17,2.54 E13.14 | C4.1 44.45,2.54 E4.14 | C15.1 v92.08,40.01 | C14.1 v92.71,19.05 | v90.81,43.81 90.17,43.18 v87.63,43.18
  Bottom 0.406: E7.14 54.61,3.81 53.98,3.17 53.98,2.54 | 53.98,2.54 53.98,1.27 C7.1 60.96,2.54 72.39,2.54 E10.14 74.93,5.08 87.63,5.08 E13.14 95.25,10.16 95.25,12.7 97.16,12.7 97.79,13.34 97.79,17.78 93.98,17.78 v92.71,19.05 | E1.14 21.59,3.81 U$4.A2 17.15,5.08 15.88,3.81 | 15.88,3.81 18.42,1.27 C1.1 32.39,1.27 33.66,2.54 41.91,2.54 E4.14 46.36,3.81 47.63,2.54 53.98,2.54 | 15.88,3.81 8.26,3.81 U$1.A2 | 73.66,22.86 73.66,21.59 C11.1 76.2,22.86 88.9,22.86 | 73.66,22.86 E11.14 | 88.9,22.86 E14.14 92.08,27.3 v92.08,40.01 | C14.1 88.9,22.86 | 58.42,22.86 E8.14 | 58.42,22.86 C8.1 61.6,21.59 62.87,22.86 73.66,22.86 | E2.14 27.94,22.86 C2.1 30.48,22.86 43.18,22.86 | 43.18,22.86 E5.14 | C5.1 43.18,22.86 | 43.18,22.86 58.42,22.86 | E15.14 88.9,41.91 C15.1 | R3.2 R2.2 110.49,53.34 110.49,51.44 102.24,43.18 91.44,43.18 C15.1 | 29.21,43.18 C3.1 | E3.14 29.21,43.18 | 44.45,43.18 44.45,44.45 E6.14 | 44.45,43.18 C6.1 | 44.45,43.18 29.21,43.18 | 59.69,43.18 59.69,42.55 | E9.14 59.69,43.18 | 73.66,43.18 73.66,41.91 C12.1 | 73.66,43.18 E12.14 | 73.66,43.18 59.69,43.18 | 44.45,43.18 51.44,43.18 52.07,42.55 59.69,42.55 | 59.69,42.55 C9.1 | C15.1 90.17,43.81 v90.81,43.81 | 73.66,43.18 v87.63,43.18

### Text on the board
Bottom: VRS | M111/M113/M115/M117/M119 Replacement
tNames: M111 | M113 | M115 | M117 | M119 | Fill Only One Row. | M113/M117/M119: Use Resistors. | M111/M115: Omit Resistors. | M111/M113/M115/M117/M119 Replacement